# EAGLE design ATTAMI-Shield-stepperDriver (EAGLE 7.1.0)
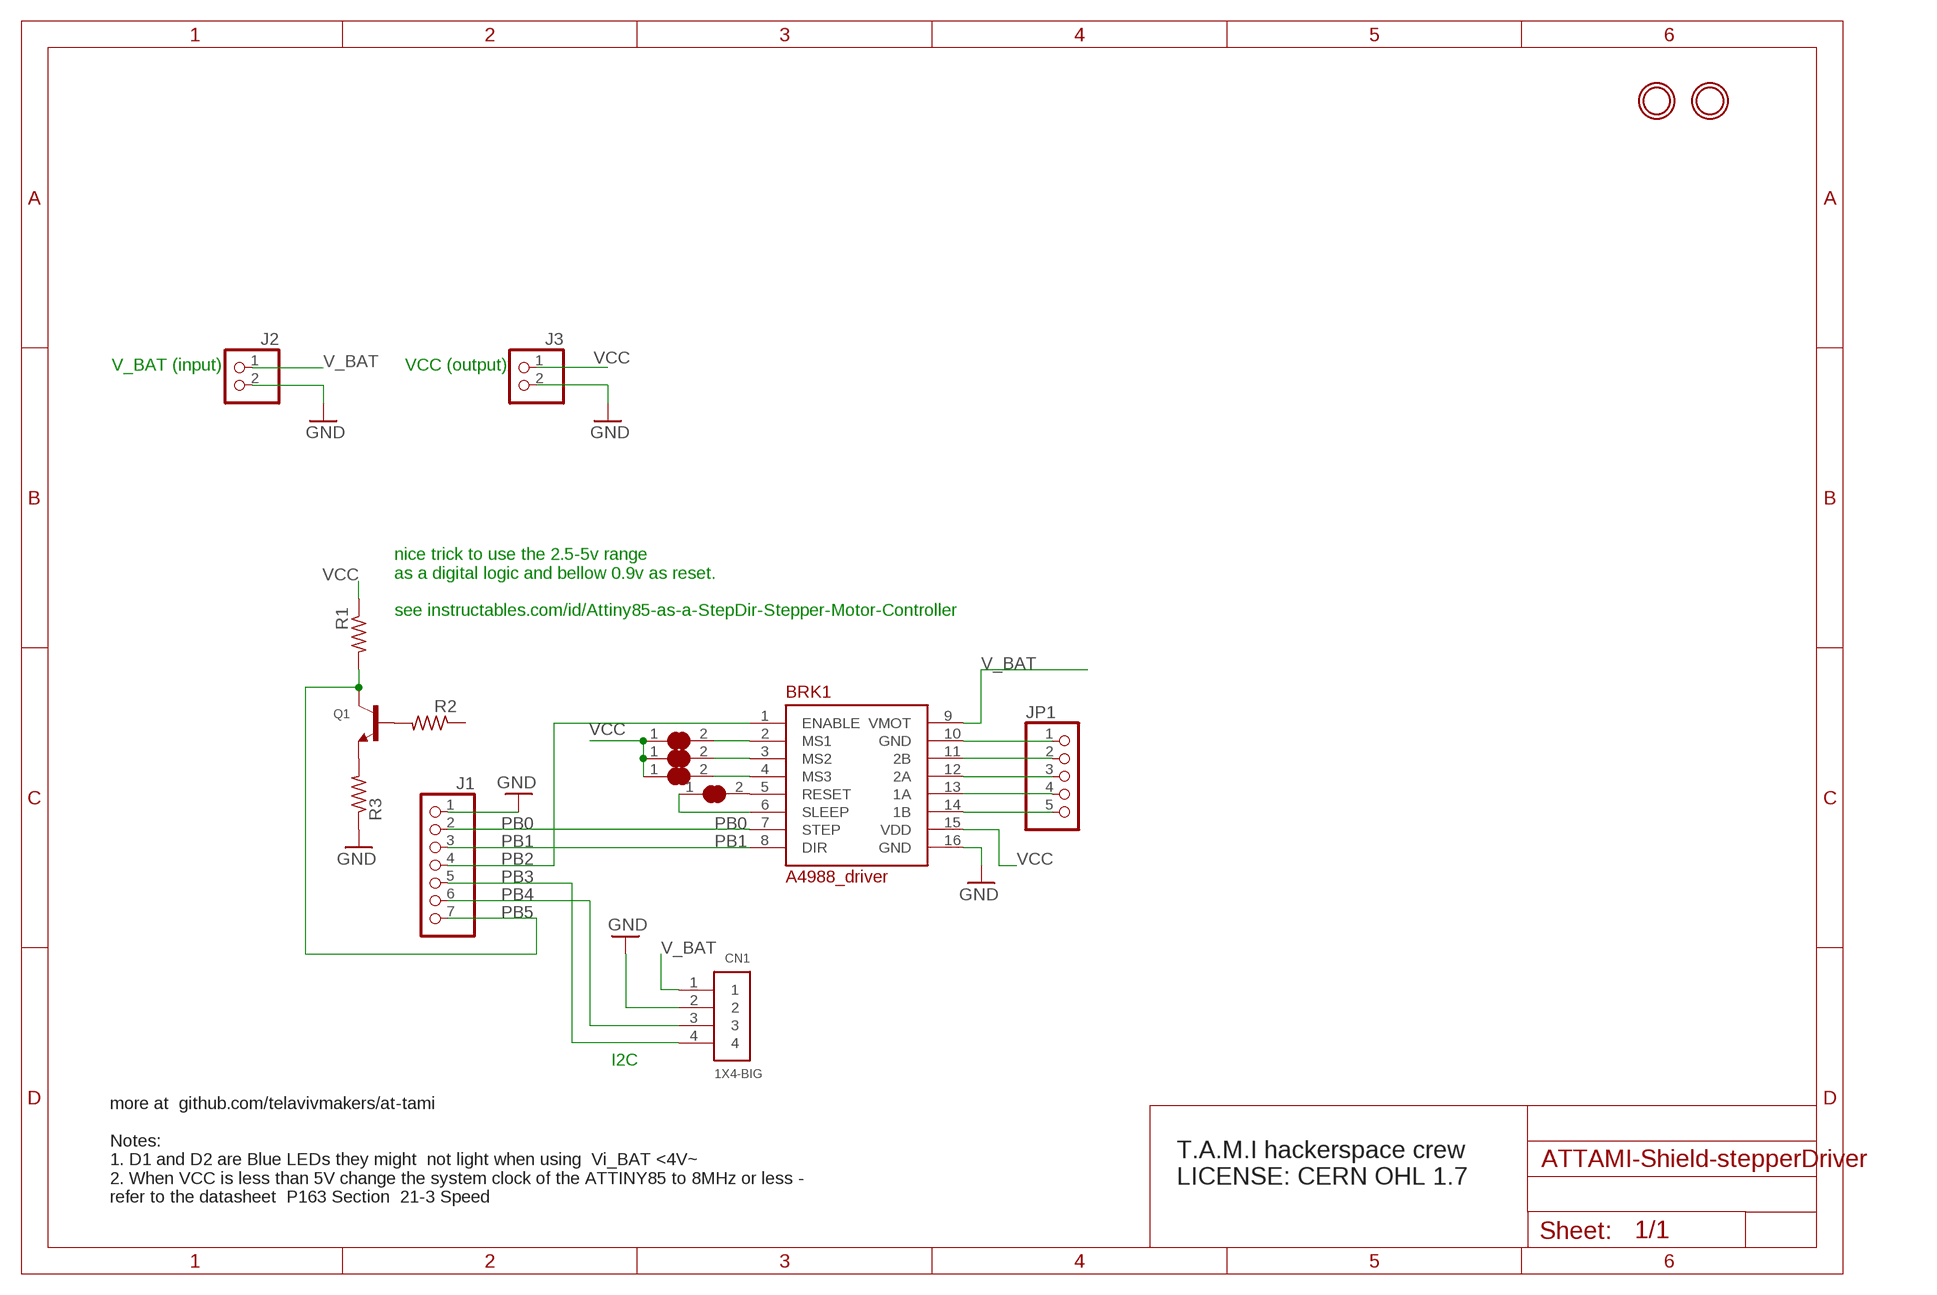
[diagram p0: schematic, sheet 1]

## Parts
BRK1  A4988_driver  A4988_DRIVER  [DIL16]
CN1  1X4-BIG  [1X04-BIG]
J1  HEADER-1X7ROUND  [1X07_ROUND]
J2  HEADER-1X2ROUND  [1X02_ROUND]
J3  HEADER-1X2ROUND  [1X02_ROUND]
JP1  HEADER-1X5  [1X05_OVAL]
Q1  TRANSISTOR_NPNWAVE  [SOT23-W]
R1  R-US_R0805  [R0805]
R2  R-US_R0805  [R0805]
R3  R-US_R0805  [R0805]
SJ1  SOLDERJUMPER_CLOSED  [SOLDERJUMPER_CLOSEDWIRE]
SJ2  SOLDERJUMPER_CLOSED  [SOLDERJUMPER_CLOSEDWIRE]
SJ3  SOLDERJUMPER_CLOSED  [SOLDERJUMPER_CLOSEDWIRE]
SJ4  SOLDERJUMPER_CLOSED  [SOLDERJUMPER_CLOSEDWIRE]
U$1  MOUNTINGHOLE2.0  [MOUNTINGHOLE_2.0_PLATED]
U$2  MOUNTINGHOLE2.0  [MOUNTINGHOLE_2.0_PLATED]

## Nets
GND: BRK1.10(GND) BRK1.16(GND) CN1.2 J1.1 J2.2 J3.2 JP1.1 R3.1
N$2: BRK1.5(RESET) SJ4.2
N$3: BRK1.11(2B) JP1.2
N$4: Q1.2(E) R3.2
N$5: Q1.1(B) R2.2
N$6: BRK1.12(2A) JP1.3
N$7: BRK1.13(1A) JP1.4
N$8: BRK1.14(1B) JP1.5
N$9: BRK1.6(SLEEP) SJ4.1
N$10: BRK1.2(MS1) SJ3.2
N$13: BRK1.3(MS2) SJ2.2
N$14: BRK1.4(MS3) SJ1.2
PB0: BRK1.7(STEP) J1.2
PB1: BRK1.8(DIR) J1.3
PB2: BRK1.1(ENABLE) J1.4
PB3: CN1.4 J1.5
PB4: CN1.3 J1.6
PB5: J1.7 Q1.3(C) R1.2
V_BAT: BRK1.9(VMOT) CN1.1 J2.1
VCC: BRK1.15(VDD) J3.1 R1.1 SJ1.1 SJ2.1 SJ3.1
Unconnected: R2.1

## Notes on the sheet
- V_BAT (input) | VCC (output)
- nice trick to use the 2.5-5v range 
  as a digital logic and bellow 0.9v as reset.
  
  see instructables.com/id/Attiny85-as-a-StepDir-Stepper-Motor-Controller
- I2C
- T.A.M.I hackerspace crew 
  LICENSE: CERN OHL 1.7
- more at  github.com/telavivmakers/at-tami
  
  Notes: 
  1. D1 and D2 are Blue LEDs they might  not light when using  Vi_BAT <4V~  
  2. When VCC is less than 5V change the system clock of the ATTINY85 to 8MHz or less - 
  refer to the datasheet  P163 Section  21-3 Speed

## Library data of the parts
BRK1 = ATtami:A4988_DRIVER
CN1 = adafruit:1X4: 4-pin connector
J1 = microbuilder:HEADER-1X7: PIN HEADER
J2 J3 = microbuilder:HEADER-1X2: PIN HEADER
JP1 = microbuilder:HEADER-1X5: PIN HEADER
Q1 = microbuilder:TRANSISTOR_NPN: NPN Transistor Transistor (NPN) 500mA 45V - BC817 [Digikey: 568-1631-1-ND] Transistor (NPN) 500mA 45V - BC817,215 [Mouser: 771-BC817-T/R] SOT23-R - SOT23 footprint optimised for use with solder paste and reflow ovens. SOT23-W - SOT23 footprint optimised for hand-soldering (larger pads).
R1-R3 = adafruit:R-US_: RESISTOR, American symbol
SJ1-SJ4 = microbuilder:SOLDERJUMPER_CLOSED: Solder Jumper - Closed These solder jumpers are closed by default CLOSEDWIRE - 10 mil trace between pads that can be cut and resoldered later CLOSEDPERM - 63 mil trace between pads for a permanent connection (used to 'bridge' two signals, a shameless hack for Eagle). Can double as a test point as well (no cream layer)
U$1 U$2 = microbuilder:MOUNTINGHOLE: Mounting Hole For #2 screws (0.086"/2.18mm width, 0.094"/2.4mm hole) use 2.5mm

## Net classes
0 default: width 0.203 mm
1 vcc: width 0.254 mm

## Board
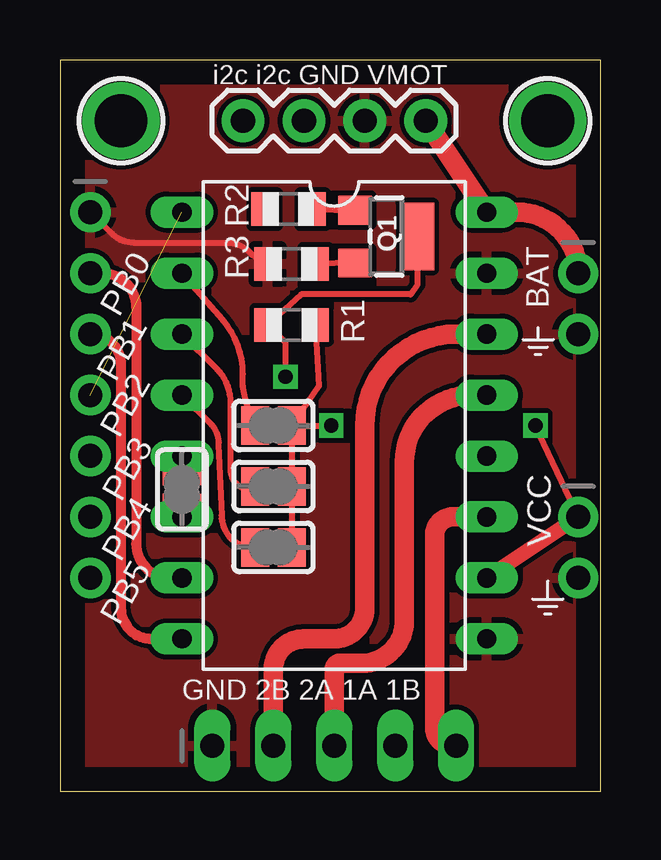
[diagram p1: board, top side]
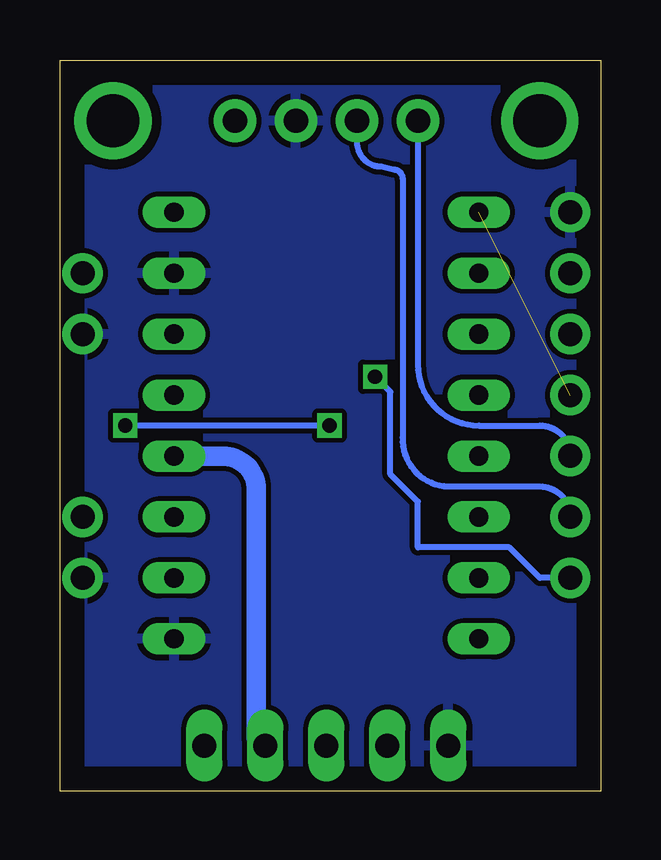
[diagram p2: board, bottom side, seen from below]

Size 22.53 x 30.47 mm. Coordinates in mm from the lower left corner, seen from the top.
Outline: 0,0 22.53,0 22.53,30.47 0,30.47 0,0
Copper layers (1*16): Top 0.035mm / dielectric 1.5mm / Bottom 0.035mm
Design rules "default": minimum track width 10mil, minimum drill 0.6mm, track to track 8mil, track to pad 8mil, pad to pad 8mil, via to via 8mil, smd to smd 8mil, copper to edge 40mil, drill to drill 8mil, minimum pad ring 10mil, minimum via ring 8mil, stop-mask expansion 4mil, vias tented up to drill 0mil, thermal gap 10mil

### Footprints (pad centres in the part's own frame; a part is rotated, then mirrored left to right if it is on the bottom)
DIL16 = drill 0.8 long: 1 -6.35,8.89; 2 -6.35,6.35; 3 -6.35,3.81; 4 -6.35,1.27; 5 -6.35,-1.27; 6 -6.35,-3.81; 7 -6.35,-6.35; 8 -6.35,-8.89; 9 6.35,8.89; 10 6.35,6.35; 11 6.35,3.81; 12 6.35,1.27; 13 6.35,-1.27; 14 6.35,-3.81; 15 6.35,-6.35; 16 6.35,-8.89
1X04-BIG = drill 1.016 pad 1.778: 1 0,0; 2 2.54,0; 3 5.08,0; 4 7.62,0
1X07_ROUND = drill 1 pad 1.676: 1 -7.62,0; 2 -5.08,0; 3 -2.54,0; 4 0,0; 5 2.54,0; 6 5.08,0; 7 7.62,0
1X02_ROUND = drill 1 pad 1.676: 1 -1.27,0; 2 1.27,0
1X05_OVAL = drill 1 long: 1 -5.08,0; 2 -2.54,0; 3 0,0; 4 2.54,0; 5 5.08,0
SOT23-W = smd 1.2 x 1.4: 1 -1.1,-1.3; 2 1.1,-1.3 | smd 2.8 x 1.4: 3 0,1.3
R0805 = smd 1.1 x 1.4: 1 -1,0; 2 1,0
SOLDERJUMPER_CLOSEDWIRE = smd 1.168 x 1.6: 1 -0.762,0; 2 0.762,0 | smd 0.635 x 0.203: WIRE 0,0
MOUNTINGHOLE_2.0_PLATED = drill 2.2 pad 3: P$1 0,0

### Placement (x,y rotation side)
BRK1  11.43,15.24 0 top
CN1  15.24,27.94 180 top
J1  1.27,16.51 270 top
J2  21.59,20.32 270 top
J3  21.59,10.16 270 top
JP1  11.43,1.91 0 top
Q1  13.59,23.11 270 top
R1  9.65,19.43 180 top
R2  9.53,24.26 0 top
R3  9.65,21.97 0 top
SJ1  8.89,10.16 180 top
SJ2  8.89,12.7 180 top
SJ3  8.89,15.24 180 top
SJ4  5.08,12.57 90 top
U$1  20.32,27.94 0 top
U$2  2.54,27.94 0 top

### Tracks (layer width: path | path; a pad name or v marks a point on that pad's centre or on a via)
GND
  Top 0.254: R3.1 8,22.34 arc54 6.98,22.86 3.07,22.86 arc-45 2.17,23.23 J1.1
  pour Bottom: -1.27,31.75 24.13,31.75 24.13,-1.27 -1.27,-1.27
  pour Top: -1.27,31.75 -1.27,-1.27 24.13,-1.27 24.13,31.75
N$2
  Top 0.406: SJ4.2 BRK1.5
N$3
  Top 0.813: JP1.2 8.89,5.08 arc-90 10.16,6.35 11.43,6.35 arc90 12.7,7.62 12.7,15.24 arc-90 16.51,19.05 BRK1.11
N$4
  Top 0.254: Q1.2 R3.2
N$5
  Top 0.254: R2.2 Q1.1
N$6
  Top 0.813: BRK1.12 17.14,16.51 arc90 14.35,13.72 14.35,7.11 arc-90 12.57,5.33 11.68,5.33 arc90 11.43,5.08 JP1.3
N$7
  Bottom 0.813: BRK1.13 15.75,13.97 arc90 14.35,12.57 14.35,2.29 arc-90 JP1.4
N$8
  Top 0.813: BRK1.14 16.51,11.43 arc90 15.62,10.79 15.62,2.54 arc90 JP1.5
N$9
  Top 0.406: BRK1.6 SJ4.1
N$10
  Top 0.254: SJ3.2 8.06,15.43 arc-18 7.62,16.89 7.62,17.39 arc41 6.78,19.64 BRK1.2
N$13
  Top 0.254: SJ2.2 7.92,12.57 arc-90 7.11,13.39 7.11,16.22 arc45 6.54,17.59 BRK1.3
N$14
  Top 0.254: BRK1.4 6.32,15.27 arc-45 6.6,14.46 6.73,11.49 arc90 8.06,10.16 SJ1.2
PB0
  Top 0.406: J1.2 1.75,21.59 arc-90 3.17,20.17 3.17,10.31 arc90 4.59,8.89 BRK1.7
PB1
  Top 0.406: J1.3 arc-90 2.54,17.78 2.54,7.62 arc90 3.81,6.35 BRK1.8
PB2  (1 unrouted)
PB3
  Bottom 0.254: CN1.4 7.62,17.78 arc-90 5.08,15.24 2.54,15.24 arc90 J1.5
PB4
  Bottom 0.254: CN1.3 10.16,27.05 arc-90 9.14,26.04 8.64,25.91 arc90 8.26,25.53 8.26,14.73 arc-90 6.35,12.7 2.54,12.7 arc90 J1.6
PB5  (via drill 0.6)
  Top 0.254: Q1.3 14.89,21.11 14.61,20.7 10.05,20.7 R1.2 9.4,18.68 v9.4,17.27
  Bottom 0.254: J1.7 2.54,8.89 3.81,10.16 7.62,10.16 7.62,12.06 8.76,13.21 8.76,16.64 v9.4,17.27
V_BAT
  Top 0.813: J2.1 arc90 19.05,24.13 BRK1.9 CN1.1
VCC  (via drill 0.6)
  Top 0.254: SJ3.1 10.79,16.89 R1.1 | SJ3.1 v11.3,15.24 | v19.81,15.24 J3.1 | SJ3.1 SJ2.1 SJ1.1
  Top 0.61: J3.1 BRK1.15
  Bottom 0.254: v11.3,15.24 v19.81,15.24

### Text on the board
tNames: i2c i2c GND VMOT | BAT | PB0 | PB1 | PB2 | PB3 | VCC | PB4 | PB5 | GND 2B 2A 1A 1B